# Altium schematic sheet tPen.SchDoc
size A3
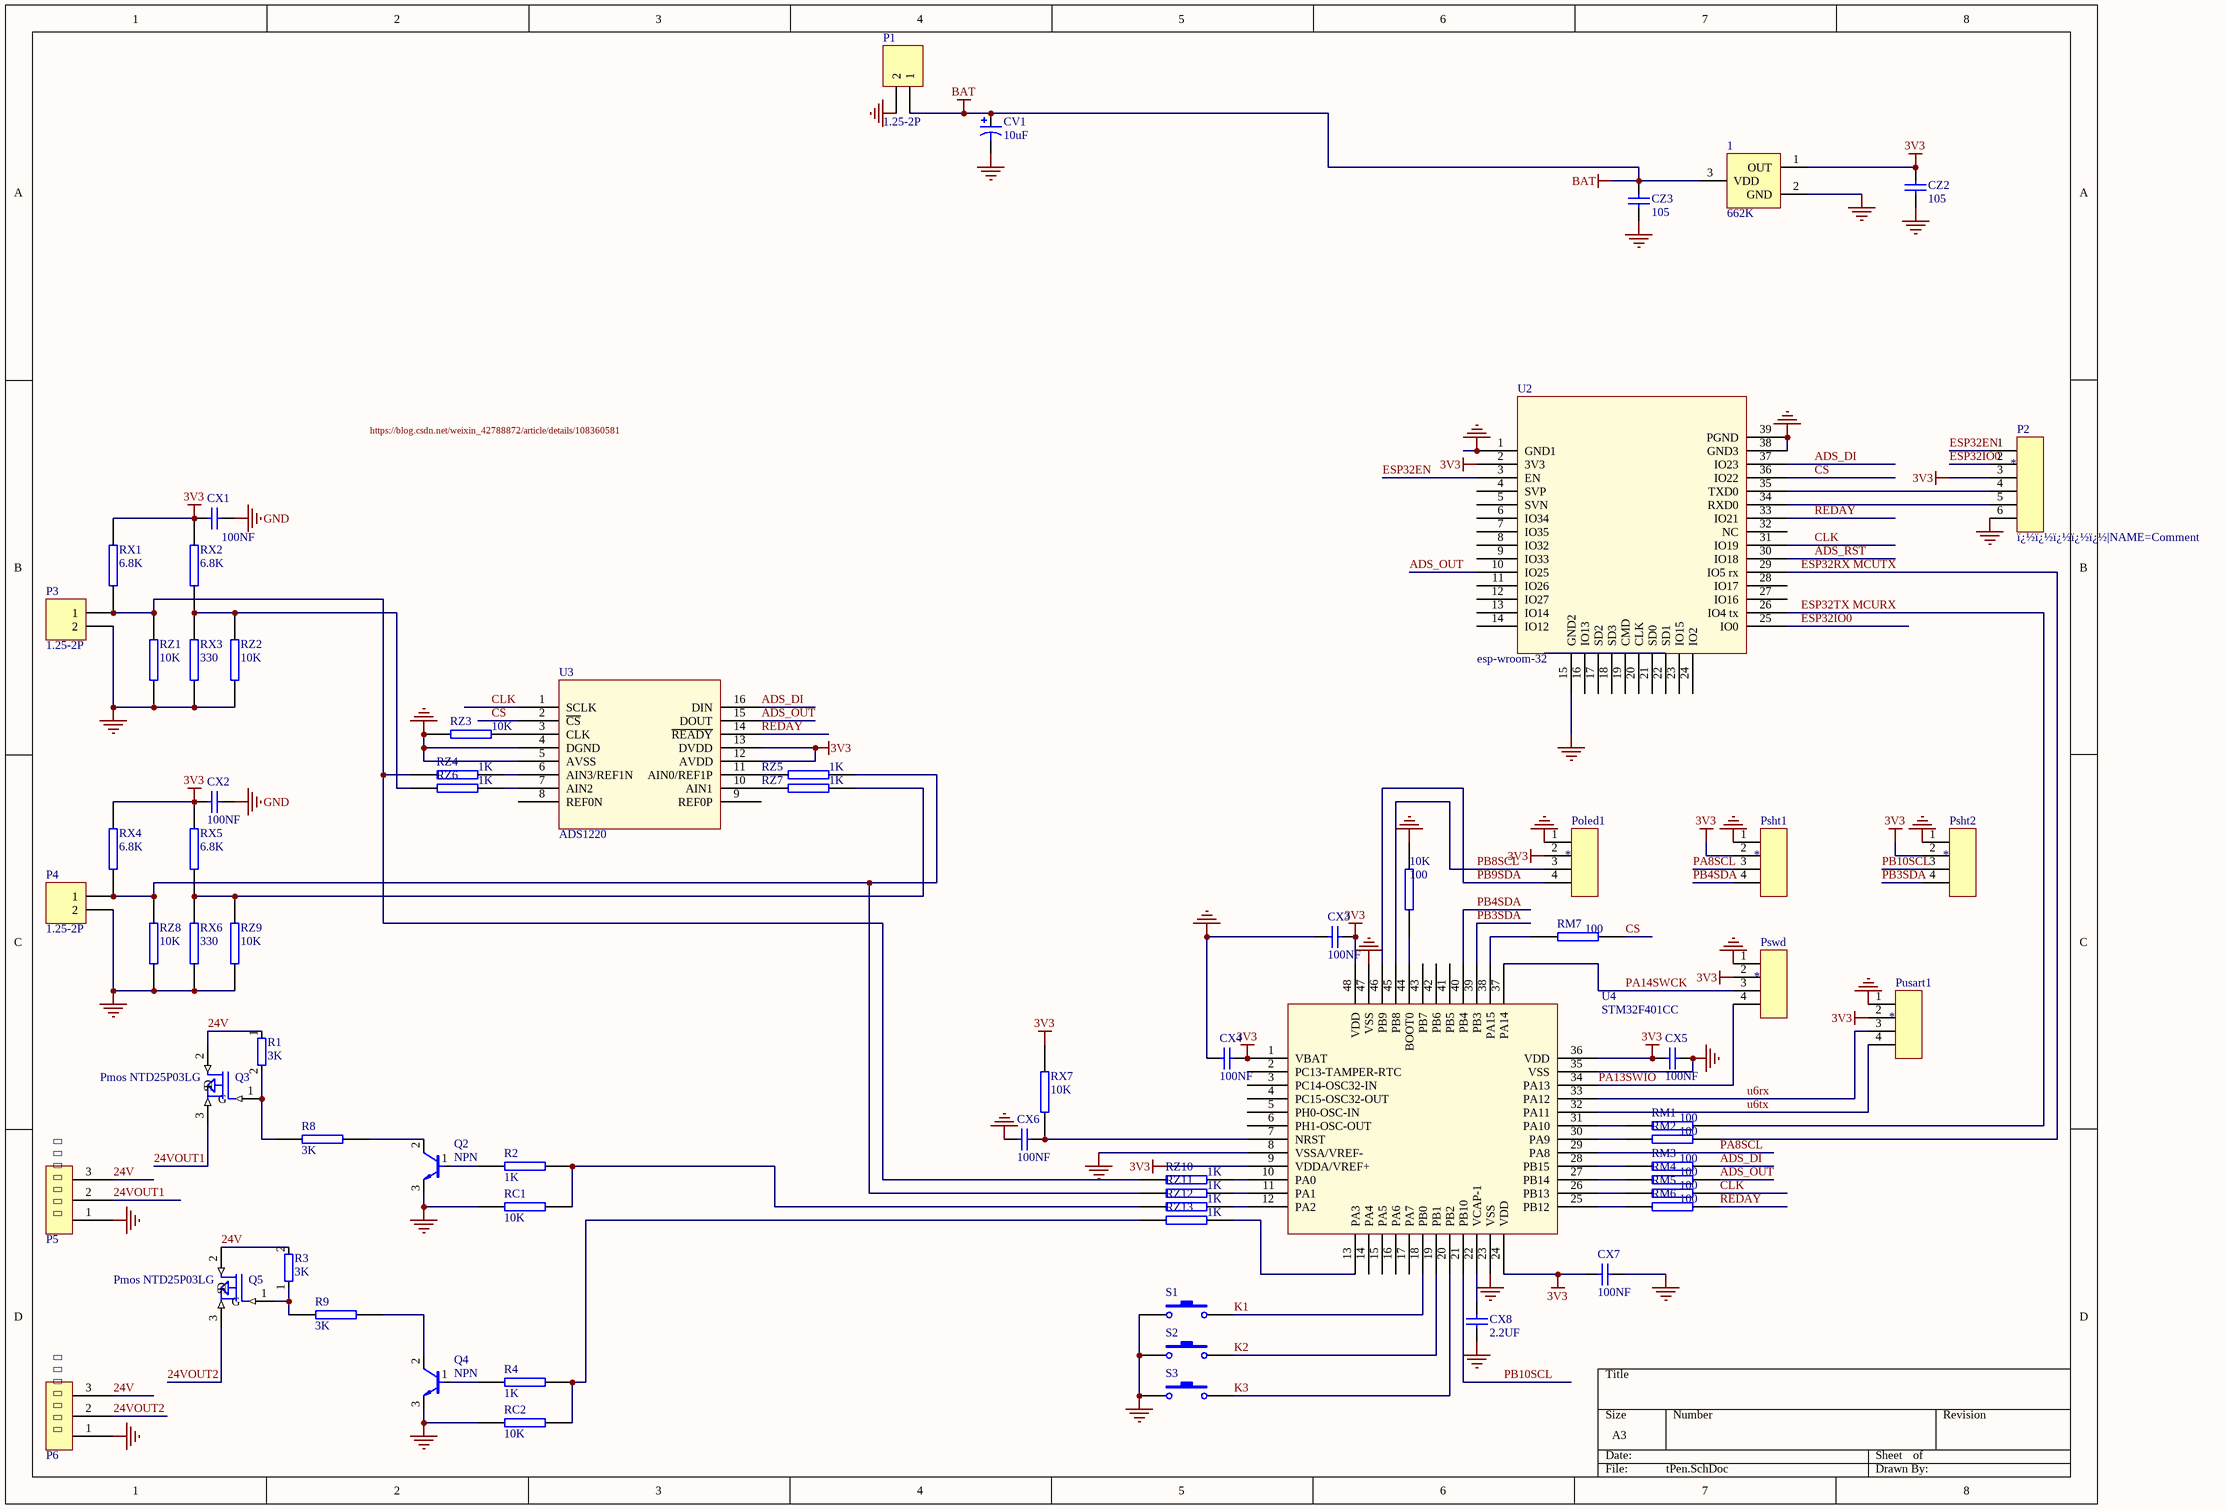
[diagram p0: tPen.SchDoc]

## Parts
1  662K  [SOT23-3-1]
10K  100  [0603]
CV1  10uF  [0603]
CX1  100NF  [0603]
CX2  100NF  [0603]
CX3  100NF  [0603]
CX4  100NF  [0603]
CX5  100NF  [0603]
CX6  100NF  [0603]
CX7  100NF  [0603]
CX8  2.2UF  [0603]
CZ2  105  [0603]
CZ3  105  [0603]
P1  1.25-2P  [1.25����-��ʽͨ��-2P]
P2  *  [B6B-XH-A]
P3  1.25-2P  [1.25����-��ʽͨ��-2P]
P4  1.25-2P  [1.25����-��ʽͨ��-2P]
P5  3P���߶���  [XH2.54-3]  (value not drawn)
P6  3P���߶���  [XH2.54-3]  (value not drawn)
Poled1  *  [0.96OLED]
Psht1  *  [B4B-XH-A]
Psht2  *  [B4B-XH-A]
Pswd  *  [B4B-XH-A]
Pusart1  *  [B4B-XH-A]
Q2  NPN  [SOT23]
Q3  Pmos NTD25P03LG
Q4  NPN  [SOT23]
Q5  Pmos NTD25P03LG
R1  3K  [0603]
R2  1K  [0603]
R3  3K  [0603]
R4  1K  [0603]
R8  3K  [0603]
R9  3K  [0603]
RC1  10K  [0603]
RC2  10K  [0603]
RM1  100  [0603]
RM2  100  [0603]
RM3  100  [0603]
RM4  100  [0603]
RM5  100  [0603]
RM6  100  [0603]
RM7  100  [0603]
RX1  6.8K  [0603]
RX2  6.8K  [0603]
RX3  330  [0603]
RX4  6.8K  [0603]
RX5  6.8K  [0603]
RX6  330  [0603]
RX7  10K  [0603]
RZ1  10K  [0603]
RZ2  10K  [0603]
RZ3  10K  [0603]
RZ4  1K  [0603]
RZ5  1K  [0603]
RZ6  1K  [0603]
RZ7  1K  [0603]
RZ8  10K  [0603]
RZ9  10K  [0603]
RZ10  1K  [0603]
RZ11  1K  [0603]
RZ12  1K  [0603]
RZ13  1K  [0603]
S1  (no value)  [��λ����]
S2  (no value)  [��λ����]
S3  (no value)  [��λ����]
U2  esp-wroom-32  [ESP32]
U3  ADS1220  [SSOP16]
U4  STM32F401CC  [STM32F401CC-UFQFPN48]

## Nets
3V3: 1.1(OUT) CX1.1 CX2.1 CX3.2 CX4.2 CX5.1 CX7.1 CZ2.1 P2.3 Poled1.2 Psht1.2 Psht2.2 Pswd.2 Pusart1.2 RX1.1 RX2.1 RX4.1 RX5.1 RX7.2 U2.2(3V3) U3.12(AVDD) U3.13(DVDD) U4.1(VBAT) U4.9(VDDA/VREF+) U4.24(VDD) U4.36(VDD) U4.48(VDD)
BAT: 1.3(VDD) CV1.1 CZ3.1 P1.1
GND: 1.2(GND) 10K.2 CV1.2 CX1.2 CX2.2 CX3.1 CX4.1 CX5.2 CX6.2 CX7.2 CX8.2 CZ2.2 CZ3.2 P1.2 P2.6 P3.2 P4.2 P5.1 P6.1 Poled1.1 Psht1.1 Psht2.1 Pswd.1 Pusart1.1 Q2.3(3e) Q4.3(3e) RC1.1 RC2.1 RX3.2 RX6.2 RZ1.2 RZ2.2 RZ3.1 RZ8.2 RZ9.2 S1.1 S2.1 S3.1 U2.1(GND1) U2.15(GND2) U2.38(GND3) U2.39(PGND) U3.4(DGND) U3.5(AVSS) U4.8(VSSA/VREF-) U4.23(VSS) U4.35(VSS) U4.47(VSS)
24V: P5.3 P6.3 Q3.2(D) Q5.2(D) R1.1 R3.2
24VOUT1: P5.2 Q3.3(S)
24VOUT2: P6.2 Q5.3(S)
ADS_DI: RM3.2 U2.37(IO23) U3.16(DIN)
ADS_OUT: RM4.2 U2.10(IO25) U3.15(DOUT)
ADS_RST: U2.30(IO18)
CLK: RM5.2 U2.31(IO19) U3.1(SCLK)
CS: RM7.2 U2.36(IO22) U3.2(~{CS})
ESP32EN: P2.1 U2.3(EN)
ESP32IO0: P2.2 U2.25(IO0)
ESP32RX MCUTX: RM2.2 U2.29(IO5_rx)
ESP32TX MCURX: RM1.2 U2.26(IO4_tx)
K1: S1.2 U4.18(PB0)
K2: S2.2 U4.19(PB1)
K3: S3.2 U4.20(PB2)
PA8SCL: Psht1.3 U4.29(PA8)
PA13SWIO: Pswd.4 U4.34(PA13)
PA14SWCK: Pswd.3 U4.37(PA14)
PB3SDA: Psht2.4 U4.39(PB3)
PB4SDA: Psht1.4 U4.40(PB4)
PB8SCL: Poled1.3 U4.45(PB8)
PB9SDA: Poled1.4 U4.46(PB9)
PB10SCL: Psht2.3 U4.21(PB10)
REDAY: RM6.2 U2.33(IO21) U3.14(~{READY})
u6rx: Pusart1.3 U4.33(PA12)
u6tx: Pusart1.4 U4.32(PA11)
Net10K_1: 10K.1 U4.44(BOOT0)
NetCX6_1: CX6.1 RX7.1 U4.7(NRST)
NetCX8_1: CX8.1 U4.22(VCAP-1)
NetP2_4: P2.4 U2.35(TXD0)
NetP2_5: P2.5 U2.34(RXD0)
NetP3_1: P3.1 RX1.2 RZ1.1 RZ4.1 RZ10.1
NetP4_1: P4.1 RX4.2 RZ5.2 RZ8.1 RZ11.1
NetQ2_1: Q2.1(1b) R2.1
NetQ2_2: Q2.2(2c) R8.2
NetQ3_1: Q3.1(G) R1.2 R8.1
NetQ4_1: Q4.1(1b) R4.1
NetQ4_2: Q4.2(2c) R9.2
NetQ5_1: Q5.1(G) R3.1 R9.1
NetR2_2: R2.2 RC1.2 RZ12.1
NetR4_2: R4.2 RC2.2 RZ13.1
NetRM1_1: RM1.1 U4.31(PA10)
NetRM2_1: RM2.1 U4.30(PA9)
NetRM3_1: RM3.1 U4.28(PB15)
NetRM4_1: RM4.1 U4.27(PB14)
NetRM5_1: RM5.1 U4.26(PB13)
NetRM6_1: RM6.1 U4.25(PB12)
NetRM7_1: RM7.1 U4.38(PA15)
NetRX2_2: RX2.2 RX3.1 RZ2.1 RZ6.1
NetRX5_2: RX5.2 RX6.1 RZ7.2 RZ9.1
NetRZ3_2: RZ3.2 U3.3(CLK)
NetRZ4_2: RZ4.2 U3.6(AIN3/REF1N)
NetRZ5_1: RZ5.1 U3.11(AIN0/REF1P)
NetRZ6_2: RZ6.2 U3.7(AIN2)
NetRZ7_1: RZ7.1 U3.10(AIN1)
NetRZ10_2: RZ10.2 U4.10(PA0)
NetRZ11_2: RZ11.2 U4.11(PA1)
NetRZ12_2: RZ12.2 U4.12(PA2)
NetRZ13_2: RZ13.2 U4.13(PA3)

Not connected (* = marked no-connect by the designer): U2 4(SVP) 5(SVN) 6(IO34) 7(IO35) 8(IO32) 9(IO33) 11(IO26) 12(IO27) 13(IO14) 14(IO12) 16(IO13) 17(SD2) 18(SD3) 19(CMD) 20(CLK) 21(SD0) 22(SD1) 23(IO15) 24(IO2) 27(IO16) 28(IO17) 32(NC); U3 8(REF0N) 9(REF0P); U4 2(PC13-TAMPER-RTC) 3(PC14-OSC32-IN) 4(PC15-OSC32-OUT) 5(PH0-OSC-IN) 6(PH1-OSC-OUT) 14(PA4) 15(PA5) 16(PA6) 17(PA7) 41(PB5) 42(PB6) 43(PB7)

## Notes on the sheet
- Labels drawn without touching a wire or pin: https://blog.csdn.net/weixin_42788872/article/details/108360581
- (in symbol 3P���߶���) ���߶���
- (in symbol ï¿½Ó²ï¿½ï¿½ï¿½ï¿?P) ï¿½ï¿½ï¿½ï¿½ï¿½|NAME=Comment

## Library data of the parts
1 = MH5330
10K R2 R4 R8 R9 RC1 RC2 RM1-RM7 RX1-RX7 RZ1-RZ13 = RES2
CV1 = Cap Pol1: Polarized Capacitor (Radial)
CX1-CX8 CZ2 CZ3 = 104: Capacitor
P1 P3 P4 = Header 2: Header, 2-Pin; LatestRevisionDate: 17-Jul-2002; LatestRevisionNote: Re-released for DXP Platform.; Publisher: Altium Limited
P2 Poled1 Psht1 Psht2 Pswd Pusart1 = ï¿½Ó²ï¿½ï¿½ï¿½ï¿?P
Q3 Q5 = MOSFET P
R1 R3 = RES
S1-S3 = �ᴥ����